# Altium schematic sheet 0805W8F1001T5E1_0805W8F1001T5E.schdoc
size 127 x 99 mm
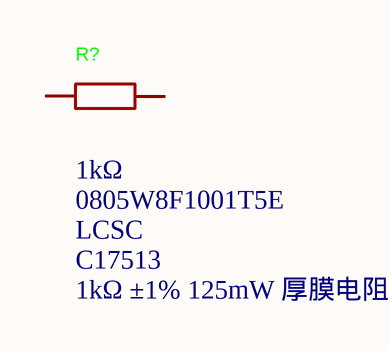
[diagram p0: 0805W8F1001T5E1_0805W8F1001T5E.schdoc]

## Parts
R?  LCSC Part Name: 1kΩ ±1% 125mW 厚膜电阻  Supplier Part: C17513  Supplier: LCSC  [R0805]  (hidden comment: 1kΩ)

## Nets

Not connected (* = marked no-connect by the designer): R? 1 2

## Library data of the parts
R? = 0805W8F1001T5E: Manufacturer: UNI-ROYAL(厚声); Add into BOM: yes; Tolerance: ±1%; Temperature Coefficient: ±100ppm/℃; Symbol: 0805W8F1001T5E; Device: 0805W8F1001T5E; Manufacturer Part: 0805W8F1001T5E; Value: 1kΩ; Supplier Footprint: 0805; JLCPCB Part Class: Basic Part; Datasheet: https://atta.szlcsc.com/upload/public/pdf/source/20200306/C422600_1E6D84923E4A46A82E41ADD87F860B5C.pdf; Convert to PCB: yes; Type: Thick Film Resistors; Operating Temperature Range: -55℃~+155℃